# EAGLE design pressure (EAGLE 9.6.2)
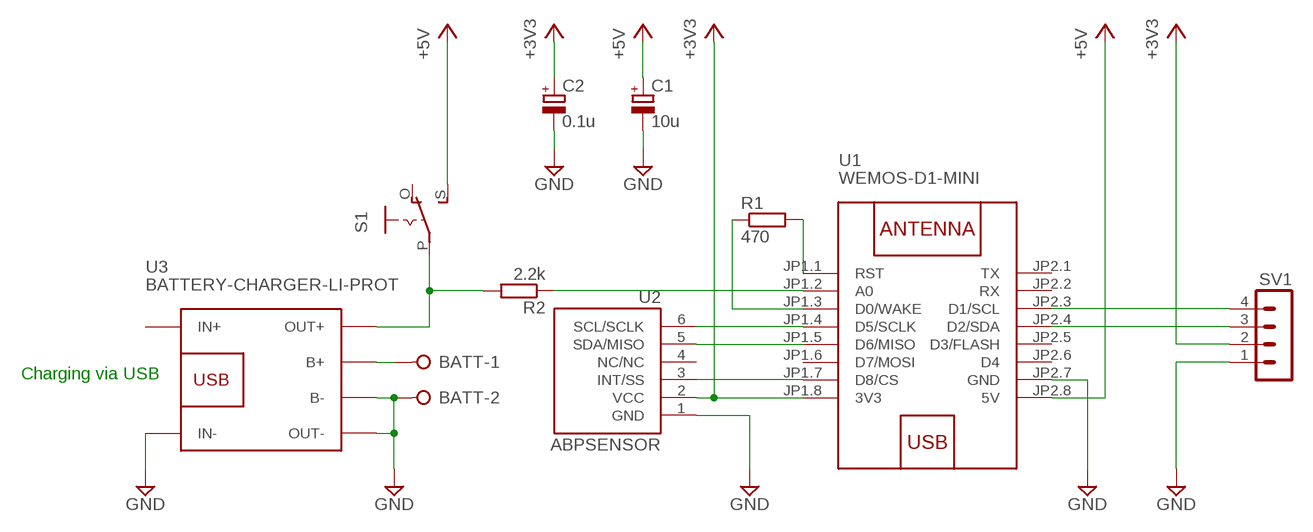
[diagram p0: schematic, sheet 1]

## Parts
BATT  W237-02P  [W237-132]
C1  10u  CPOL-EUE2.5-5  [E2,5-5]
C2  0.1u  CPOL-EUE2.5-5  [E2,5-5]
R1  470  R-EU_0207/10  [0207/10]
R2  2.2k  R-EU_0207/10  [0207/10]
S1  EG1218S  [EG1218]
SV1  4-DIGIT-LED  MA04-1  [MA04-1]
U1  WEMOS-D1-MINI  [WEMOS-D1-MINI]
U2  ABPSENSOR  [ABP-DIP6]
U3  BATTERY-CHARGER-LI-PROT  [BATTERY-CHARGER-LI-PROT]

## Nets
+3V3: C2.+ SV1.2 U1.JP1.8(3V3) U2.2(VCC)
+5V: C1.+ S1.S U1.JP2.8(5V)
GND: BATT.2 C1.- C2.- SV1.1 U1.JP2.7(GND) U2.1(GND) U3.B- U3.IN- U3.OUT-
N$1: U1.JP1.5(D6/MISO) U2.5(SDA/MISO)
N$2: U1.JP1.4(D5/SCLK) U2.6(SCL/SCLK)
N$3: SV1.3 U1.JP2.4(D2/SDA)
N$4: U1.JP1.7(D8/CS) U2.3(INT/SS)
N$5: SV1.4 U1.JP2.3(D1/SCL)
N$6: R1.1 U1.JP1.3(D0/WAKE)
N$7: R1.2 U1.JP1.1(RST)
N$8: BATT.1 U3.B+
N$9: R2.1 U1.JP1.2(A0)
N$10: R2.2 S1.P U3.OUT+
Unconnected: S1.O U1.JP1.6(D7/MOSI) U1.JP2.1(TX) U1.JP2.2(RX) U1.JP2.5(D3/FLASH) U1.JP2.6(D4) U2.4(NC/NC) U3.IN+

## Notes on the sheet
- Charging via USB

## Library data of the parts
BATT = magnus:W237-02P: WAGO SREW CLAMP; OC_FARNELL: unknown; OC_NEWARK: unknown
C1 C2 = magnus:CPOL-EU: POLARIZED CAPACITOR, European symbol
R1 R2 = resistor:R-EU_: RESISTOR, European symbol
S1 = adafruit:EG1218: SLIDING SWITCH 0.1" spacing through hole, vertical SPDT slide switch http://www.ladyada.net/library/pcb/eaglelibrary.html
SV1 = magnus:MA04-1: PIN HEADER; OC_FARNELL: unknown; OC_NEWARK: unknown
U1 = magnus:WEMOS-D1-MINI: WEMOS D1 mini: Mini Wi-Fi Board based on ESP-8266 device More details can be found here: https://www.wemos.cc/product/d1-mini.html Click here to find device on ebay.com <http://www.ebay.com/sch/wemos+d1+mini+nodemcu>
U2 = magnus:ABPSENSOR: Honeywell ABP Pressure Sensor Digital (I2C/SPI) version. DIP Package only
U3 = diy-modules:BATTERY-CHARGER-LI-PROT: Lithium Battery 5V Charger with protection circuit More details available here: http://www.instructables.com/id/DIY-Lithium-ion-Battery-Charger/step4/TP4056-based-lithium-ion-battery-charger-module/ Click here to find device on ebay.com <http://www.ebay.com/sch/tp4056+charger+usb+protection>

## Net classes
0 default: clearance 0.205 mm

## Board
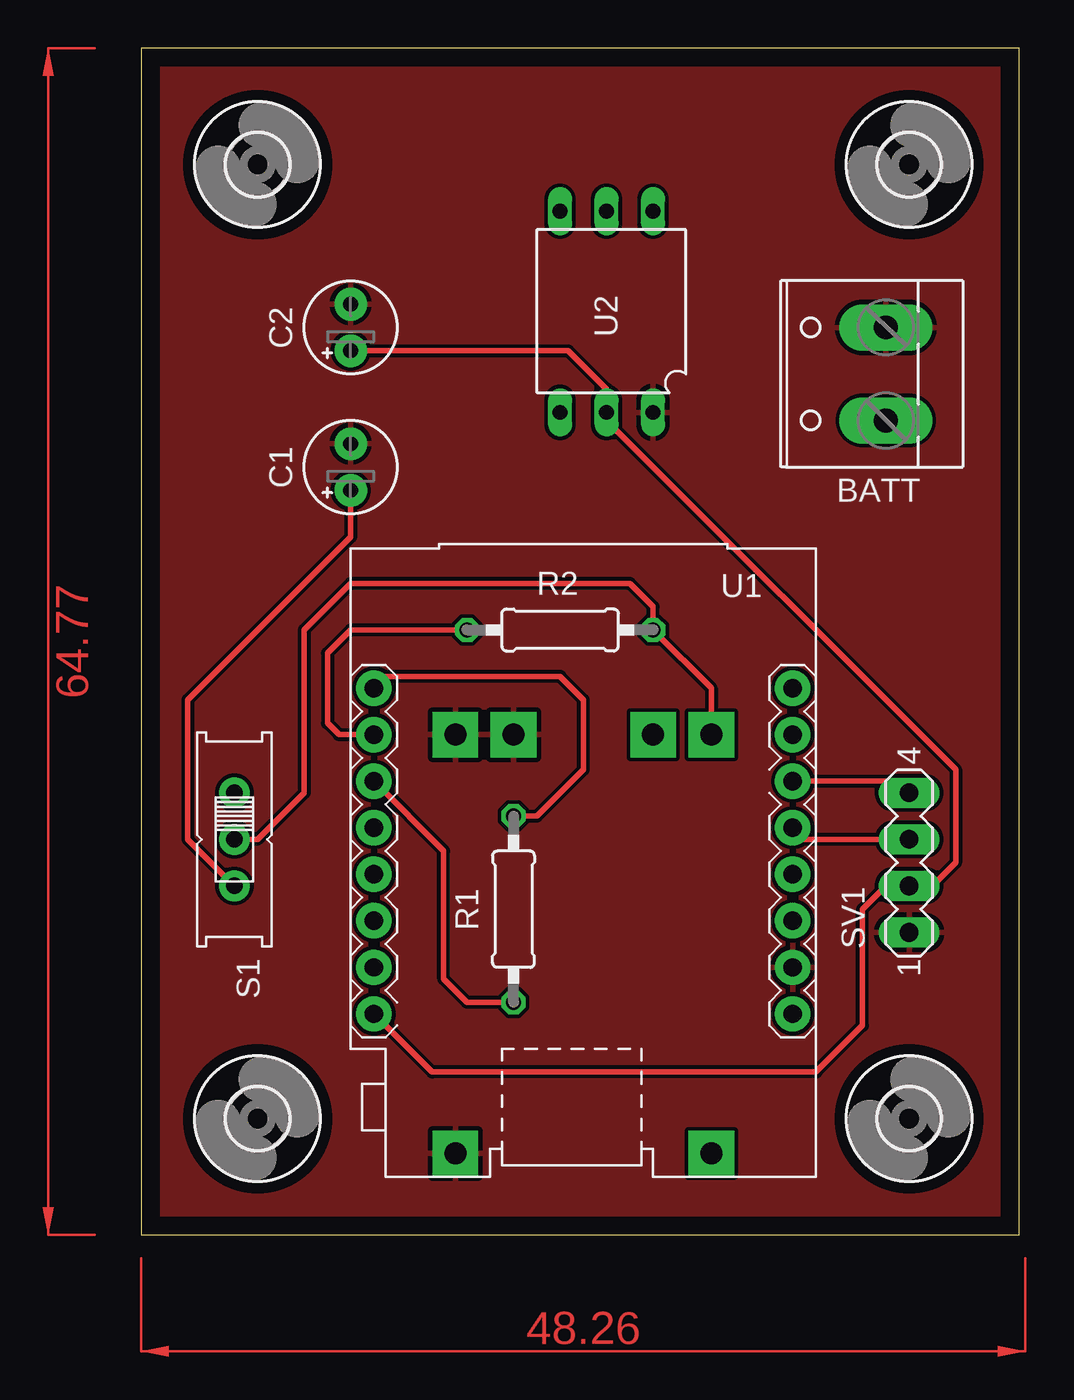
[diagram p1: board, top side]
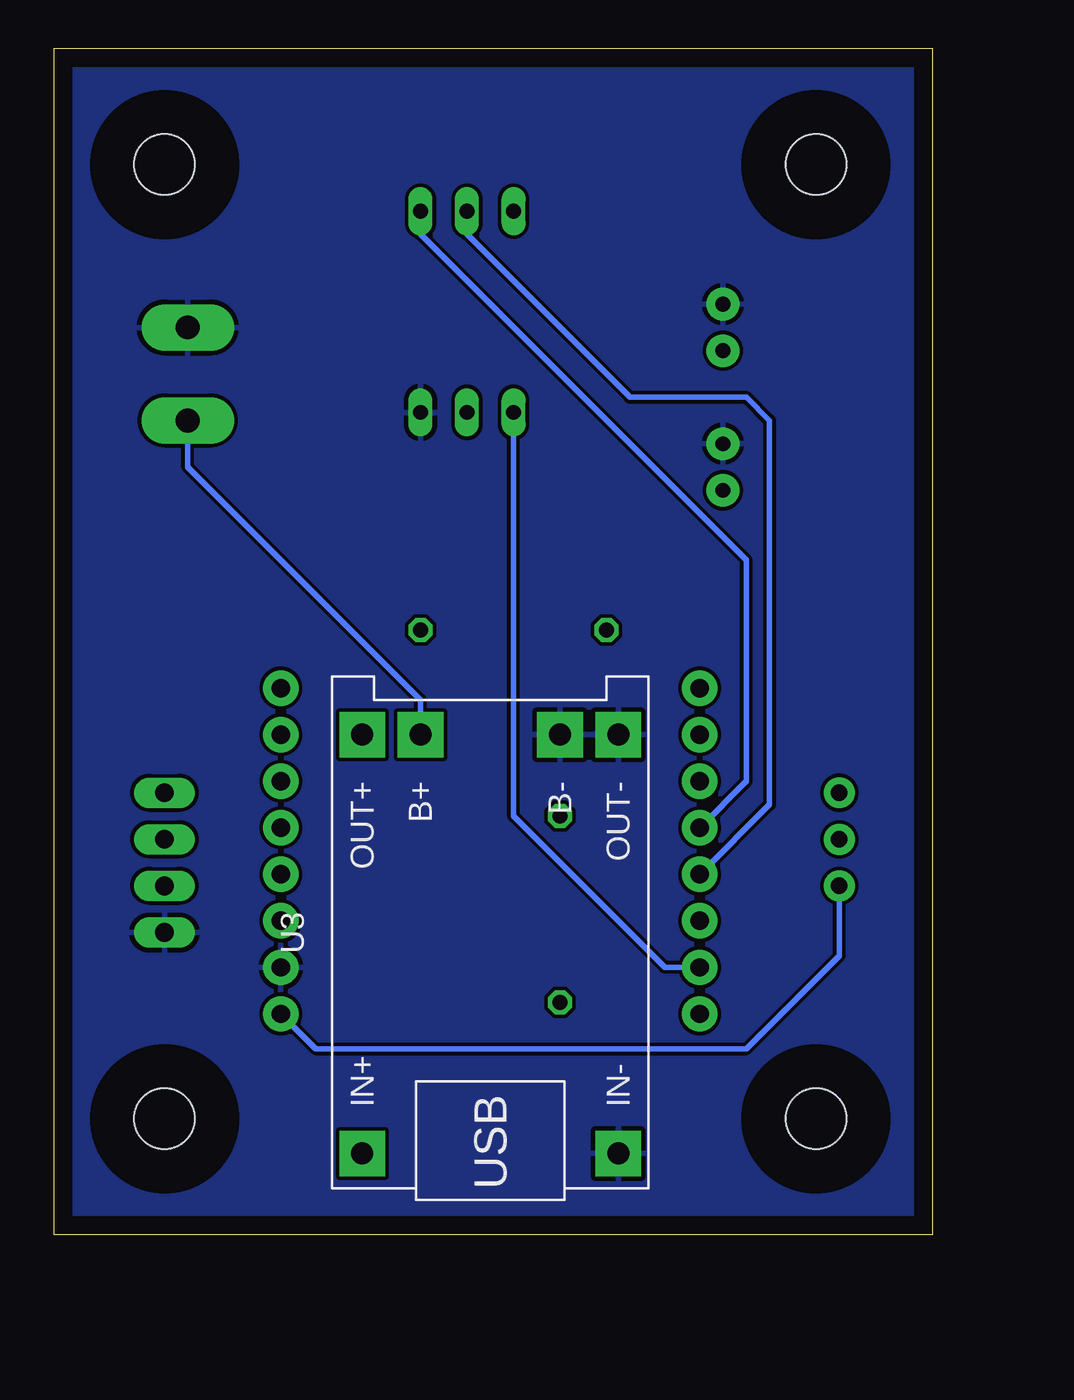
[diagram p2: board, bottom side, seen from below]

Size 47.93 x 64.76 mm. Coordinates in mm from the lower left corner, seen from the top.
Outline: 0,0 47.93,0 47.93,64.76 0,64.76 0,0
Copper layers (1*16): Top 0.035mm / dielectric 1.5mm / Bottom 0.035mm
Design rules "default": minimum track width 6mil, minimum drill 0.35mm, track to track 6mil, track to pad 6mil, pad to pad 6mil, via to via 6mil, smd to smd 6mil, copper to edge 40mil, drill to drill 6mil, minimum pad ring 10mil, minimum via ring 8mil, stop-mask expansion 4mil, vias tented up to drill 0mil, thermal gap 10mil

### Footprints (pad centres in the part's own frame; a part is rotated, then mirrored left to right if it is on the bottom)
W237-132 = drill 1.3 pad 2.54 long: 1 -2.54,0; 2 2.54,0
E2,5-5 = drill 0.8 pad 1.778: + -1.27,0; - 1.27,0
0207/10 = drill 0.813 octagon: 1 -5.08,0; 2 5.08,0
EG1218 = drill 0.9 pad 1.676: O -2.54,0; P 0,0; S 2.54,0
MA04-1 = drill 1.016 pad 1.676 long: 1 -3.81,0; 2 -1.27,0; 3 1.27,0; 4 3.81,0
WEMOS-D1-MINI = drill 1 pad 1.93: JP1.1 -11.43,9.525; JP1.2 -11.43,6.985; JP1.3 -11.43,4.445; JP1.4 -11.43,1.905; JP1.5 -11.43,-0.635; JP1.6 -11.43,-3.175; JP1.7 -11.43,-5.715; JP1.8 -11.43,-8.255; JP2.1 11.43,9.525; JP2.2 11.43,6.985; JP2.3 11.43,4.445; JP2.4 11.43,1.905; JP2.5 11.43,-0.635; JP2.6 11.43,-3.175; JP2.7 11.43,-5.715; JP2.8 11.43,-8.255
ABP-DIP6 = drill 0.813 long: 1 1.27,-7.176; 2 -1.27,-7.176; 3 -3.81,-7.176; 4 -3.81,3.81; 5 -1.27,3.81; 6 1.27,3.81
BATTERY-CHARGER-LI-PROT = drill 1.2 pad 2.5 square: B+ 10.795,3.81; B- 10.795,-3.81; IN+ -12.065,6.985; IN- -12.065,-6.985; OUT+ 10.795,6.985; OUT- 10.795,-6.985
3,3 = hole 3.3: 0,0

### Placement (x,y rotation side)
BATT  40.64,46.99 90 top
C1  11.43,41.91 90 top
C2  11.43,49.53 90 top
R1  20.32,17.78 90 top
R2  22.86,33.02 0 top
S1  5.08,21.59 270 top
SV1  41.91,20.32 90 top
U1  24.13,20.32 0 top
U2  26.67,52.07 0 top
U3  24.13,16.51 90 bottom
U$1  [3,3]  6.35,6.35 0 top
U$2  [3,3]  41.91,6.35 0 top
U$3  [3,3]  41.91,58.42 0 top
U$4  [3,3]  6.35,58.42 0 top

### Tracks (layer width: path | path; a pad name or v marks a point on that pad's centre or on a via)
+3V3
  Top 0.305: C2.+ 23.3,48.26 25.4,46.16 U2.2 25.4,44.45 44.45,25.4 44.45,20.32 43.18,19.05 SV1.2 40.64,19.05 39.37,17.78 39.37,11.43 36.83,8.89 15.88,8.89 U1.JP1.8
+5V
  Top 0.305: C1.+ 11.43,38.1 2.54,29.21 2.54,21.59 S1.S
  Bottom 0.305: U1.JP2.8 33.66,10.16 10.16,10.16 5.08,15.24 S1.S
GND
  pour Top: 0,64.77 48.26,64.77 48.26,0 0,0
  pour Bottom: 0,64.77 48.26,64.77 48.26,0 0,0
N$1
  Bottom 0.305: U1.JP1.5 8.89,23.5 8.89,44.45 10.16,45.72 16.51,45.72 25.4,54.61 U2.5
N$2
  Bottom 0.305: U1.JP1.4 10.16,24.77 10.16,36.83 27.94,54.61 U2.6
N$3
  Top 0.305: SV1.3 36.2,21.59 U1.JP2.4
N$4
  Bottom 0.305: U1.JP1.7 14.61,14.61 22.86,22.86 U2.3
N$5
  Top 0.305: U1.JP2.3 41.27,24.77 SV1.4
N$6
  Top 0.305: U1.JP1.3 16.51,20.96 16.51,13.97 17.78,12.7 R1.1
N$7
  Top 0.305: R1.2 21.59,22.86 24.13,25.4 24.13,29.21 22.86,30.48 13.34,30.48 U1.JP1.1
N$8
  Bottom 0.305: U3.B+ 27.94,29.21 40.64,41.91 BATT.1
N$9
  Top 0.305: R2.1 11.43,33.02 10.16,31.75 10.16,27.94 10.8,27.3 U1.JP1.2
N$10
  Top 0.305: U3.OUT+ 31.12,29.84 R2.2 27.94,34.29 26.67,35.56 11.43,35.56 8.89,33.02 8.89,24.13 6.35,21.59 S1.P
(copper drawn outside any net)
  shapes: Top area x2